# EAGLE design Amstrad-CPC-Z80-DART-1-0 (EAGLE 9.6.2)
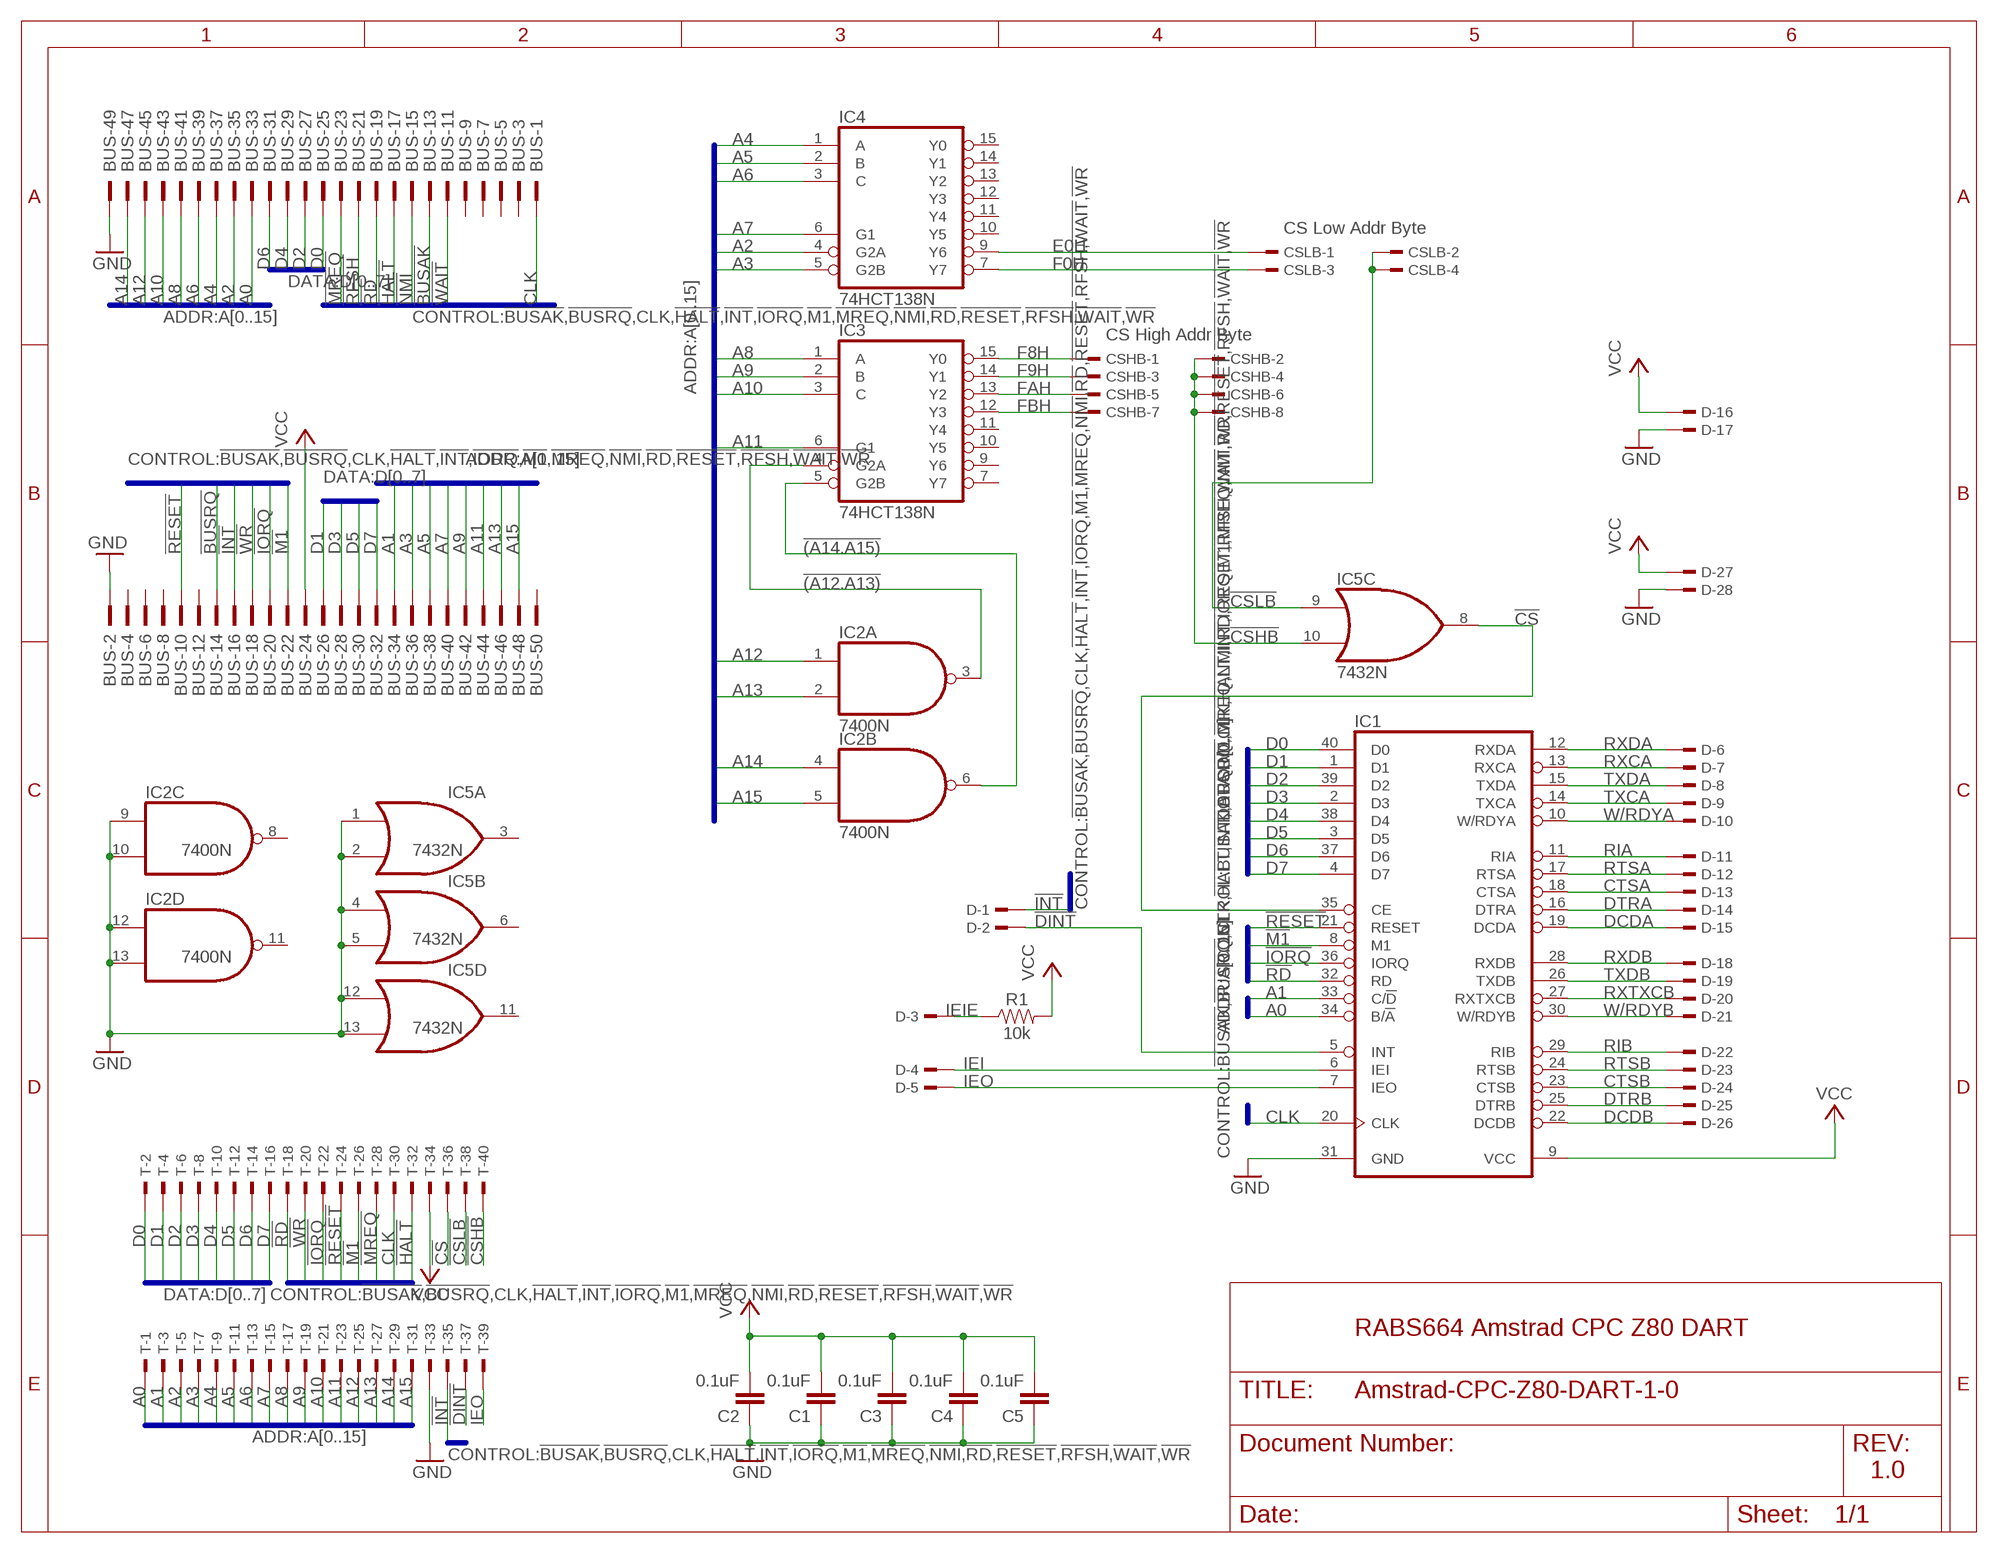
[diagram p0: schematic, sheet 1]

## Parts
BUS  2550-  [PAK100/2500-50]
C1  0.1uF  C-EU050-025X075  [C050-025X075]
C2  0.1uF  C-EU050-025X075  [C050-025X075]
C3  0.1uF  C-EU050-025X075  [C050-025X075]
C4  0.1uF  C-EU050-025X075  [C050-025X075]
C5  0.1uF  C-EU050-025X075  [C050-025X075]
CSHB  TSW-104-07-G-D  [TSW-104-XX-G-D]
CSLB  TSW-102-07-G-D  [TSW-102-XX-G-D]
D  TSW-128-07-G-S  [TSW-128-XX-G-S]
IC1  Z80DART  [DIL40]
IC2  7400N  [DIL14]
IC3  74HCT138N  [DIL16]
IC4  74HCT138N  [DIL16]
IC5  7432N  [DIL14]
R1  10k  10KOHM-HORIZ-1/4W-1%  [AXIAL-0.3]
T  TSW-120-07-G-D  [TSW-120-XX-G-D]

## Nets
!(A12.A13): IC2.3(A:O) IC3.4(G2A)
!(A14.A15): IC2.6(B:O) IC3.5(G2B)
!BUSAK: BUS.13
!BUSRQ: BUS.14
!CS: IC1.35(CE) IC5.8(C:O) T.36
!CSHB: CSHB.2 CSHB.4 CSHB.6 CSHB.8 IC5.10(C:I1) T.40
!CSLB: CSLB.2 CSLB.4 IC5.9(C:I0) T.38
!DINT: D.2 IC1.5(INT) T.37
!HALT: BUS.17 T.32
!INT: BUS.16 D.1 T.35
!IORQ: BUS.20 IC1.36(IORQ) T.22
!M1: BUS.22 IC1.8(M1) T.26
!MREQ: BUS.23 T.28
!NMI: BUS.15
!RD: BUS.19 IC1.32(RD) T.18
!RESET: BUS.10 IC1.21(RESET) T.24
!RFSH: BUS.21
!WAIT: BUS.11
!WR: BUS.18 T.20
A0: BUS.33 IC1.34(B/!A) T.1
A1: BUS.34 IC1.33(C/!D) T.3
A2: BUS.35 IC4.4(G2A) T.5
A3: BUS.36 IC4.5(G2B) T.7
A4: BUS.37 IC4.1(A) T.9
A5: BUS.38 IC4.2(B) T.11
A6: BUS.39 IC4.3(C) T.13
A7: BUS.40 IC4.6(G1) T.15
A8: BUS.41 IC3.1(A) T.17
A9: BUS.42 IC3.2(B) T.19
A10: BUS.43 IC3.3(C) T.21
A11: BUS.44 IC3.6(G1) T.23
A12: BUS.45 IC2.1(A:I0) T.25
A13: BUS.46 IC2.2(A:I1) T.27
A14: BUS.47 IC2.4(B:I0) T.29
A15: BUS.48 IC2.5(B:I1) T.31
CLK: BUS.1 IC1.20(CLK) T.30
CTSA: D.13 IC1.18(CTSA)
CTSB: D.24 IC1.23(CTSB)
D0: BUS.25 IC1.40(D0) T.2
D1: BUS.26 IC1.1(D1) T.4
D2: BUS.27 IC1.39(D2) T.6
D3: BUS.28 IC1.2(D3) T.8
D4: BUS.29 IC1.38(D4) T.10
D5: BUS.30 IC1.3(D5) T.12
D6: BUS.31 IC1.37(D6) T.14
D7: BUS.32 IC1.4(D7) T.16
DCDA: D.15 IC1.19(DCDA)
DCDB: D.26 IC1.22(DCDB)
DTRA: D.14 IC1.16(DTRA)
DTRB: D.25 IC1.25(DTRB)
E0H: CSLB.1 IC4.9(Y6)
F0H: CSLB.3 IC4.7(Y7)
F8H: CSHB.1 IC3.15(Y0)
F9H: CSHB.3 IC3.14(Y1)
FAH: CSHB.5 IC3.13(Y2)
FBH: CSHB.7 IC3.12(Y3)
GND [supply]: BUS.2 BUS.49 C1.1 C2.1 C3.1 C4.1 C5.1 D.17 D.28 IC1.31(GND) IC2.9(C:I0) IC2.10(C:I1) IC2.12(D:I0) IC2.13(D:I1) IC5.1(A:I0) IC5.2(A:I1) IC5.4(B:I0) IC5.5(B:I1) IC5.12(D:I0) IC5.13(D:I1) T.33
IEI: D.4 IC1.6(IEI)
IEIE: D.3 R1.P$1
IEO: D.5 IC1.7(IEO) T.39
RIA: D.11 IC1.11(RIA)
RIB: D.22 IC1.29(RIB)
RTSA: D.12 IC1.17(RTSA)
RTSB: D.23 IC1.24(RTSB)
RXCA: D.7 IC1.13(RXCA)
RXDA: D.6 IC1.12(RXDA)
RXDB: D.18 IC1.28(RXDB)
RXTXCB: D.20 IC1.27(RXTXCB)
TXCA: D.9 IC1.14(TXCA)
TXDA: D.8 IC1.15(TXDA)
TXDB: D.19 IC1.26(TXDB)
VCC [supply]: BUS.24 C1.2 C2.2 C3.2 C4.2 C5.2 D.16 D.27 IC1.9(VCC) R1.P$2 T.34
W/RDYA: D.10 IC1.10(W/RDYA)
W/RDYB: D.21 IC1.30(W/RDYB)
Unconnected: BUS.3 BUS.4 BUS.5 BUS.6 BUS.7 BUS.8 BUS.9 BUS.12 BUS.50 IC2.8(C:O) IC2.11(D:O) IC3.7(Y7) IC3.9(Y6) IC3.10(Y5) IC3.11(Y4) IC4.10(Y5) IC4.11(Y4) IC4.12(Y3) IC4.13(Y2) IC4.14(Y1) IC4.15(Y0) IC5.3(A:O) IC5.6(B:O) IC5.11(D:O)

## Buses
ADDR:A[0..15]
DATA:D[0..7]
CONTROL:!BUSAK,!BUSRQ,CLK,!HALT,!INT,!IORQ,!M1,!MREQ,!NMI,!RD,!RESET,!RFSH,!WAIT,!WR

## Notes on the sheet
- CS Low Addr Byte
- CS High Addr Byte
- RABS664 Amstrad CPC Z80 DART
- 1.0

## Power pins joined to a net without a drawn wire
GND: IC2.7(P:GND) IC3.8(GND) IC4.8(GND) IC5.7(P:GND)
VCC: IC2.14(P:VCC) IC3.16(VCC) IC4.16(VCC) IC5.14(P:VCC)

## Library data of the parts
BUS = con-3m:2550-: 3M (TM) Pak 100 4-Wall Header Source: 3M; OC_FARNELL: unknown; OC_NEWARK: unknown; SPICEPREFIX: X
C1-C5 = rcl:C-EU: CAPACITOR, European symbol; SPICEPREFIX: C
CSHB = con-samtec:TSW-104-*-G: THROUGH-HOLE .025" SQ POST HEADER Source: Samtec TSW.pdf; MF: Samtec Inc.; MPN: TSW-104-07-G-D
CSLB = con-samtec:TSW-102-*-G: THROUGH-HOLE .025" SQ POST HEADER Source: Samtec TSW.pdf; MF: Samtec Inc.; MPN: TSW-102-07-G-D
D = con-samtec:TSW-128-*-G-S: THROUGH-HOLE .025" SQ POST HEADER Source: Samtec TSW.pdf; MF: Samtec Inc.; MPN: TSW-128-07-G-S
IC1 = zilog:Z80DART: Z80 FAMILY DEVICE
IC2 = 74xx-us:74*00: Quad 2-input NAND gate
IC3 IC4 = 74xx-eu:74*138: 3-line to 8-line DECODER/DEMULTIPLEXER
IC5 = 74xx-us:74*32: Quad 2-input OR gate
R1 = SparkFun-Resistors:10KOHM: 10kΩ resistor A resistor is a passive two-terminal electrical component that implements electrical resistance as a circuit element. Resistors act to reduce current flow, and, at the same time, act to lower voltage levels within circuits. - Wikipedia; PROD_ID: RES-12183
T = con-samtec:TSW-120-*-G: THROUGH-HOLE .025" SQ POST HEADER Source: Samtec TSW.pdf; MF: Samtec Inc.; MPN: TSW-120-07-G-D

## Net classes
0 default: width 0.254 mm, clearance 0.254 mm
1 supply: width 0.508 mm, clearance 0.508 mm

## Board
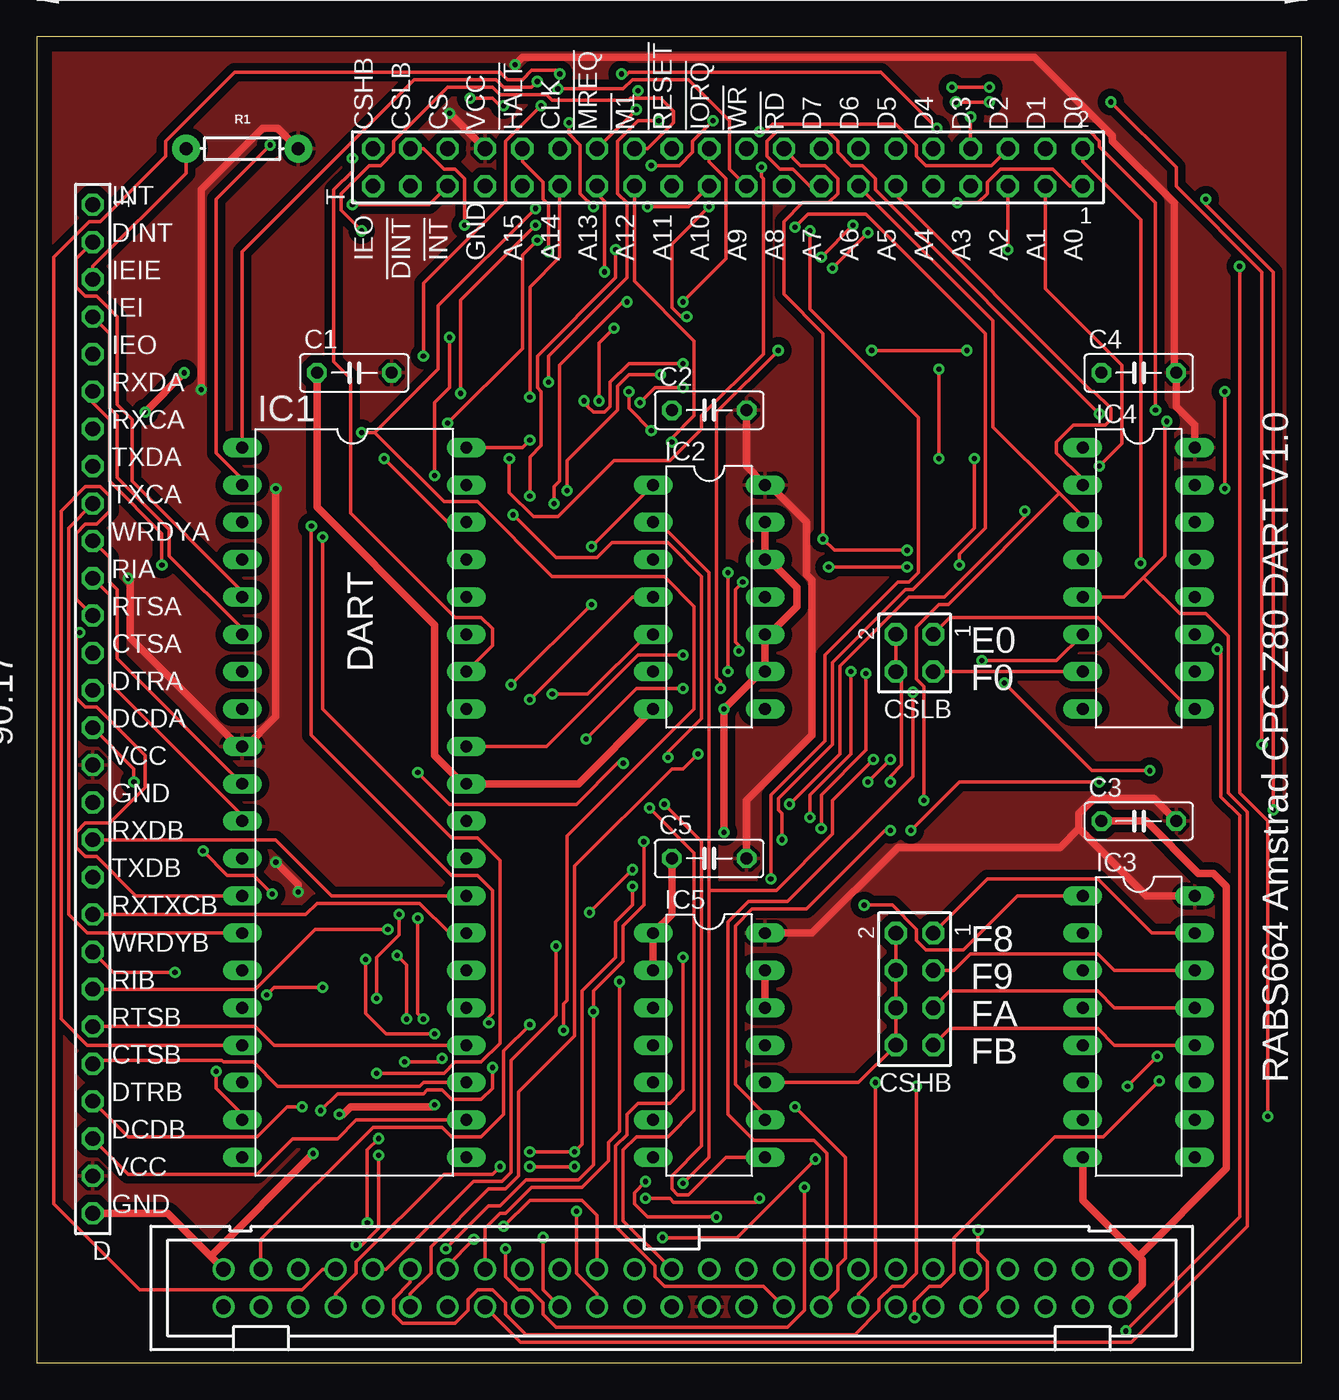
[diagram p1: board, top side]
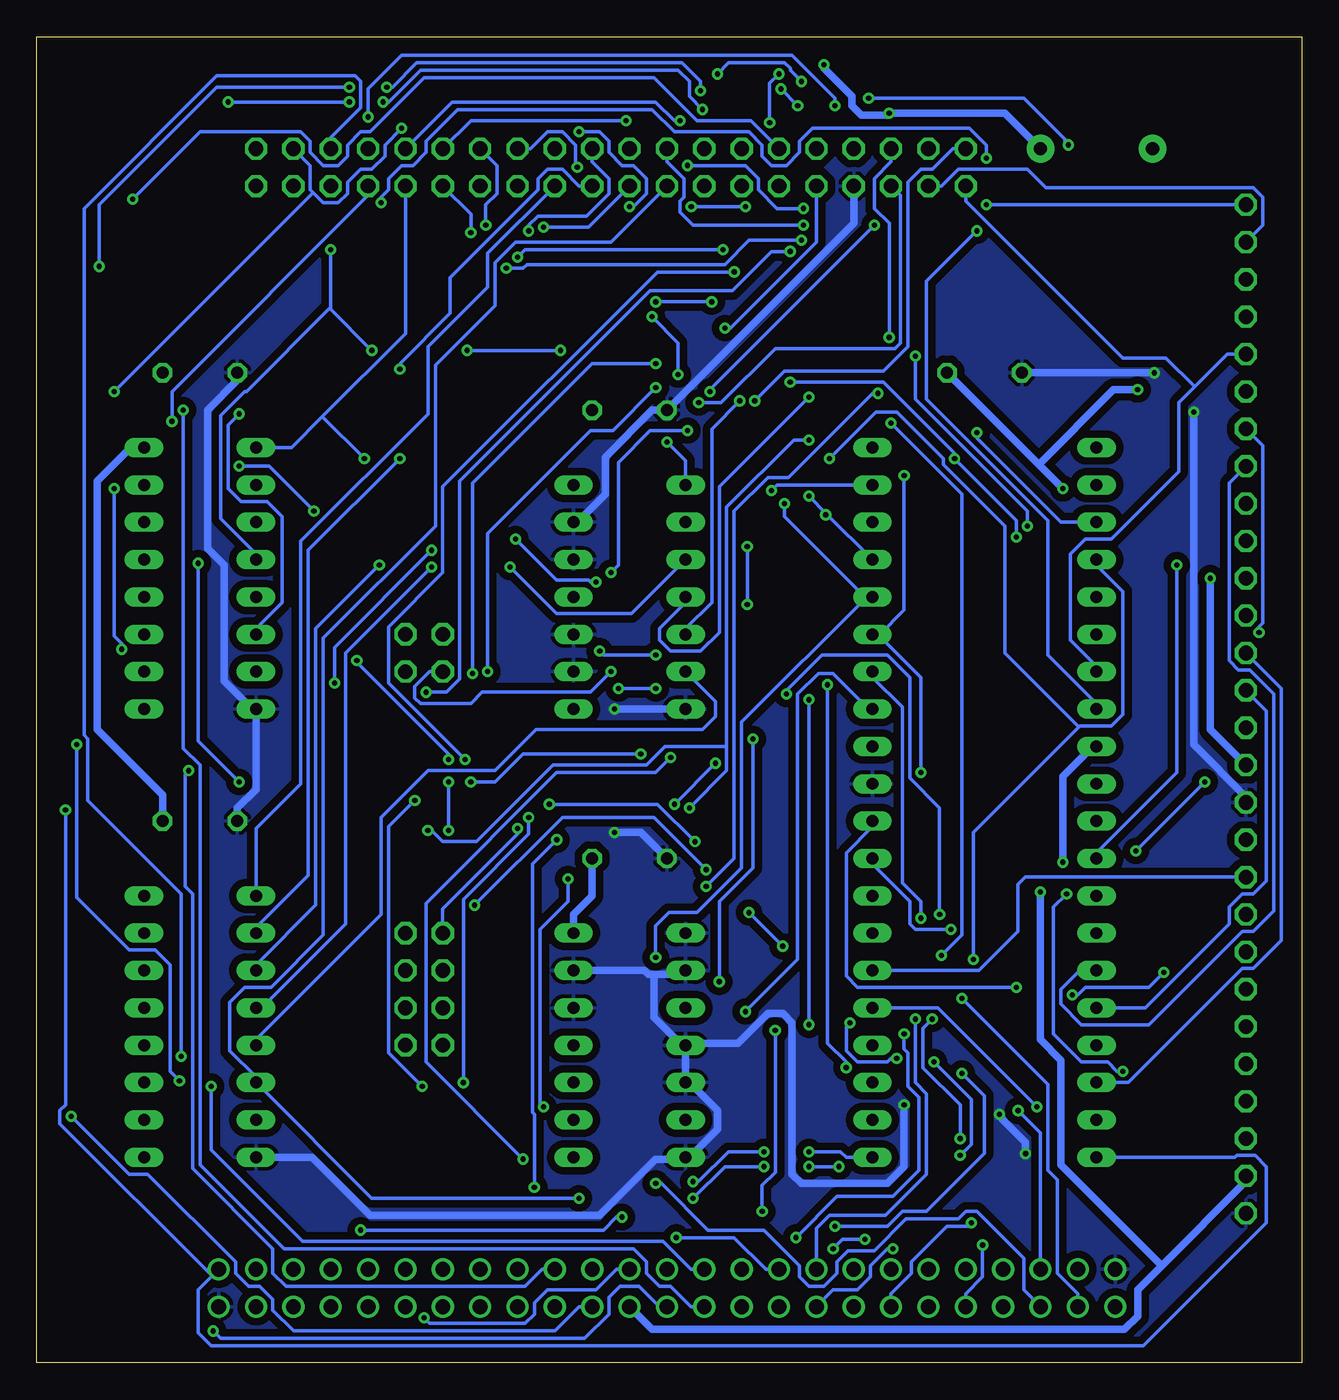
[diagram p2: board, bottom side, seen from below]

Size 86.03 x 90.16 mm. Coordinates in mm from the lower left corner, seen from the top.
Outline: 0,0 86.03,0 86.03,90.16 0,90.16 0,0
Copper layers (1*16): Top 0.035mm / dielectric 1.5mm / Bottom 0.035mm
Design rules "default": minimum track width 6mil, minimum drill 0.35mm, track to track 6mil, track to pad 6mil, pad to pad 6mil, via to via 6mil, smd to smd 6mil, copper to edge 40mil, drill to drill 6mil, minimum pad ring 10mil, minimum via ring 8mil, stop-mask expansion 4mil, vias tented up to drill 0mil, thermal gap 10mil

### Footprints (pad centres in the part's own frame; a part is rotated, then mirrored left to right if it is on the bottom)
PAK100/2500-50 = drill 1 pad 1.422: 1 -30.48,-1.27; 2 -30.48,1.27; 3 -27.94,-1.27; 4 -27.94,1.27; 5 -25.4,-1.27; 6 -25.4,1.27; 7 -22.86,-1.27; 8 -22.86,1.27; 9 -20.32,-1.27; 10 -20.32,1.27; 11 -17.78,-1.27; 12 -17.78,1.27; 13 -15.24,-1.27; 14 -15.24,1.27; 15 -12.7,-1.27; 16 -12.7,1.27; 17 -10.16,-1.27; 18 -10.16,1.27; 19 -7.62,-1.27; 20 -7.62,1.27; 21 -5.08,-1.27; 22 -5.08,1.27; 23 -2.54,-1.27; 24 -2.54,1.27; 25 0,-1.27; 26 0,1.27; 27 2.54,-1.27; 28 2.54,1.27; 29 5.08,-1.27; 30 5.08,1.27; 31 7.62,-1.27; 32 7.62,1.27; 33 10.16,-1.27; 34 10.16,1.27; 35 12.7,-1.27; 36 12.7,1.27; 37 15.24,-1.27; 38 15.24,1.27; 39 17.78,-1.27; 40 17.78,1.27; 41 20.32,-1.27; 42 20.32,1.27; 43 22.86,-1.27; 44 22.86,1.27; 45 25.4,-1.27; 46 25.4,1.27; 47 27.94,-1.27; 48 27.94,1.27; 49 30.48,-1.27; 50 30.48,1.27
C050-025X075 = drill 0.813 octagon: 1 -2.54,0; 2 2.54,0
TSW-104-XX-G-D = drill 1 pad 1.5 octagon: 1 3.81,-1.27; 2 3.81,1.27; 3 1.27,-1.27; 4 1.27,1.27; 5 -1.27,-1.27; 6 -1.27,1.27; 7 -3.81,-1.27; 8 -3.81,1.27
TSW-102-XX-G-D = drill 1 pad 1.5 octagon: 1 1.27,-1.27; 2 1.27,1.27; 3 -1.27,-1.27; 4 -1.27,1.27
TSW-128-XX-G-S = drill 1 pad 1.5 octagon: 1 34.29,0; 2 31.75,0; 3 29.21,0; 4 26.67,0; 5 24.13,0; 6 21.59,0; 7 19.05,0; 8 16.51,0; 9 13.97,0; 10 11.43,0; 11 8.89,0; 12 6.35,0; 13 3.81,0; 14 1.27,0; 15 -1.27,0; 16 -3.81,0; 17 -6.35,0; 18 -8.89,0; 19 -11.43,0; 20 -13.97,0; 21 -16.51,0; 22 -19.05,0; 23 -21.59,0; 24 -24.13,0; 25 -26.67,0; 26 -29.21,0; 27 -31.75,0; 28 -34.29,0
DIL40 = drill 0.813 long: 1 -24.13,-7.62; 2 -21.59,-7.62; 3 -19.05,-7.62; 4 -16.51,-7.62; 5 -13.97,-7.62; 6 -11.43,-7.62; 7 -8.89,-7.62; 8 -6.35,-7.62; 9 -3.81,-7.62; 10 -1.27,-7.62; 11 1.27,-7.62; 12 3.81,-7.62; 13 6.35,-7.62; 14 8.89,-7.62; 15 11.43,-7.62; 16 13.97,-7.62; 17 16.51,-7.62; 18 19.05,-7.62; 19 21.59,-7.62; 20 24.13,-7.62; 21 24.13,7.62; 22 21.59,7.62; 23 19.05,7.62; 24 16.51,7.62; 25 13.97,7.62; 26 11.43,7.62; 27 8.89,7.62; 28 6.35,7.62; 29 3.81,7.62; 30 1.27,7.62; 31 -1.27,7.62; 32 -3.81,7.62; 33 -6.35,7.62; 34 -8.89,7.62; 35 -11.43,7.62; 36 -13.97,7.62; 37 -16.51,7.62; 38 -19.05,7.62; 39 -21.59,7.62; 40 -24.13,7.62
DIL14 = drill 0.813 long: 1 -7.62,-3.81; 2 -5.08,-3.81; 3 -2.54,-3.81; 4 0,-3.81; 5 2.54,-3.81; 6 5.08,-3.81; 7 7.62,-3.81; 8 7.62,3.81; 9 5.08,3.81; 10 2.54,3.81; 11 0,3.81; 12 -2.54,3.81; 13 -5.08,3.81; 14 -7.62,3.81
DIL16 = drill 0.813 long: 1 -8.89,-3.81; 2 -6.35,-3.81; 3 -3.81,-3.81; 4 -1.27,-3.81; 5 1.27,-3.81; 6 3.81,-3.81; 7 6.35,-3.81; 8 8.89,-3.81; 9 8.89,3.81; 10 6.35,3.81; 11 3.81,3.81; 12 1.27,3.81; 13 -1.27,3.81; 14 -3.81,3.81; 15 -6.35,3.81; 16 -8.89,3.81
AXIAL-0.3 = drill 0.9 pad 1.88: P$1 -3.81,0; P$2 3.81,0
TSW-120-XX-G-D = drill 1 pad 1.5 octagon: 1 24.13,-1.27; 2 24.13,1.27; 3 21.59,-1.27; 4 21.59,1.27; 5 19.05,-1.27; 6 19.05,1.27; 7 16.51,-1.27; 8 16.51,1.27; 9 13.97,-1.27; 10 13.97,1.27; 11 11.43,-1.27; 12 11.43,1.27; 13 8.89,-1.27; 14 8.89,1.27; 15 6.35,-1.27; 16 6.35,1.27; 17 3.81,-1.27; 18 3.81,1.27; 19 1.27,-1.27; 20 1.27,1.27; 21 -1.27,-1.27; 22 -1.27,1.27; 23 -3.81,-1.27; 24 -3.81,1.27; 25 -6.35,-1.27; 26 -6.35,1.27; 27 -8.89,-1.27; 28 -8.89,1.27; 29 -11.43,-1.27; 30 -11.43,1.27; 31 -13.97,-1.27; 32 -13.97,1.27; 33 -16.51,-1.27; 34 -16.51,1.27; 35 -19.05,-1.27; 36 -19.05,1.27; 37 -21.59,-1.27; 38 -21.59,1.27; 39 -24.13,-1.27; 40 -24.13,1.27

### Placement (x,y rotation side)
BUS  43.18,5.08 180 top
C1  21.59,67.31 0 top
C2  45.72,64.77 0 top
C3  74.93,36.83 0 top
C4  74.93,67.31 0 top
C5  45.72,34.29 0 top
CSHB  59.69,25.4 90 top
CSLB  59.69,48.26 90 top
D  3.81,44.45 90 top
IC1  21.59,38.1 270 top
IC2  45.72,52.07 270 top
IC3  74.93,22.86 270 top
IC4  74.93,53.34 270 top
IC5  45.72,21.59 270 top
R1  13.97,82.55 0 top
T  46.99,81.28 0 top

### Tracks (layer width: path | path; a pad name or v marks a point on that pad's centre or on a via)
!(A12.A13)  (via drill 0.35)
  Top 0.254: v53.85,54.1 v59.18,54.1
  Bottom 0.254: IC3.4 70.74,24.13 65.02,29.84 65.02,48.26 v59.18,54.1 | v53.85,54.1 50.67,50.93 45.59,50.93 IC2.3
!(A14.A15)
  Bottom 0.254: IC3.5 71.12,21.97 62.61,30.48 62.61,37.08 59.44,40.26 54.86,40.26 52.07,43.05 40.77,43.05 39.88,43.94 39.88,44.96 IC2.6
!CS  (via drill 0.35)
  Top 0.254: IC5.8 46.86,13.97 44.32,11.43 43.56,11.43 43.18,11.81 43.18,12.7 45.21,14.73 45.21,35.43 v42.67,37.97 | v39.88,40.77 39.5,40.77 36.7,37.97 28.07,37.97 v25.91,40.13 | v28.07,69.72 28.07,66.29 27.05,65.28 v27.05,60.33
  Bottom 0.254: v39.88,40.77 v42.67,37.97 | v25.91,40.13 25.91,46.61 28.83,49.53 IC1.35 28.7,49.53 27.05,51.18 v27.05,60.33 | T.36 27.94,81.66 29.08,80.52 29.08,78.49 28.07,77.47 v28.07,69.72
!CSHB  (via drill 0.35)
  Top 0.254: IC5.10 55.88,19.05 CSHB.8 CSHB.6 CSHB.4 CSHB.2 | v37.21,65.41 37.47,65.15 37.47,65.02 37.85,64.64 38.61,64.64 38.99,65.02 38.99,66.67 40.26,67.94 v43.94,67.94 | v56.39,46.86 56.39,41.66 53.34,38.61 v53.34,36.32
  Bottom 0.254: T.40 23.75,82.55 25.15,81.15 25.91,81.15 26.8,80.26 26.8,69.09 28.45,67.44 35.18,67.44 v37.21,65.41 | v43.94,67.94 48.26,67.94 56.39,59.82 v56.39,46.86 | v53.34,36.32 53.34,35.94 58.42,30.86 CSHB.2
!CSLB  (via drill 0.35)
  Top 0.254: IC5.9 49.53,16.89 47.5,18.92 47.5,29.72 48.64,30.86 52.32,30.86 57.66,36.2 v58.04,36.2 | v58.04,39.5 58.04,39.88 58.8,40.64 58.8,46.61 CSLB.4 CSLB.2 | T.38 26.29,82.55 27.69,81.15 28.45,81.15 29.08,80.52 v29.08,77.34 | v40.26,66.04 40.26,64.9 v41.78,63.37 | v46.99,46.99 v46.99,53.72
  Bottom 0.254: v58.04,39.5 v58.04,36.2 | v29.08,77.34 40.26,66.17 v40.26,66.04 | v41.78,63.37 44.32,63.37 46.48,61.21 46.48,54.23 v46.99,53.72 | v46.99,46.99 48.39,45.59 55.75,45.59 56.52,44.83 59.94,44.83 60.33,45.21 60.33,45.97 59.31,46.99 CSLB.4
!DINT
  Top 0.254: IC1.5 13.97,52.45 6.48,59.94 6.48,64.14 5.46,65.15 5.46,71.12 4.06,72.52 3.3,72.52 2.67,73.15 2.67,75.06 D.2
  Bottom 0.254: T.37 24.51,80.01 23.37,81.15 18.67,81.15 17.4,79.88 3.3,79.88 2.67,79.25 2.67,77.34 D.2
!HALT  (via drill 0.35)
  Top 0.254: T.32 33.02,81.66 34.42,80.26 34.42,79.12 34.8,78.74 v34.8,75.56 | v59.56,45.59 59.56,39.88 51.05,31.37 48.39,31.37 46.99,29.97 46.99,16.89 48.77,15.11 52.83,15.11 53.72,14.22 53.72,6.73 BUS.17
  Bottom 0.254: v34.8,75.56 36.07,75.56 38.73,72.9 44.32,72.9 57.28,59.94 57.28,46.48 58.17,45.59 v59.56,45.59
!INT  (via drill 0.35)
  Top 0.254: v21.46,78.74 26.67,78.74 T.35 | BUS.16 55.88,4.7 57.02,5.84 v57.02,19.05 | v52.58,37.08 52.58,38.61 55.37,41.4 v55.37,46.99 | v43.94,66.29 42.04,66.29 v41.02,65.28
  Bottom 0.254: v21.46,78.74 D.1 | v57.02,19.05 57.02,31.5 52.58,35.94 v52.58,37.08 | v55.37,46.99 55.37,56.39 48.39,63.37 46.86,63.37 v43.94,66.29 | v41.02,65.28 39.5,65.28 35.81,68.96 27.69,68.96 27.3,69.34 27.3,79.38 T.35
!IORQ  (via drill 0.35)
  Top 0.254: v43.94,27.56 43.94,18.54 43.05,17.65 40.89,17.65 40.13,16.89 40.13,15.49 39.37,14.73 39.37,9.27 42.04,6.6 42.04,5.84 42.67,5.21 49.4,5.21 BUS.20 | T.22 45.72,81.66 46.86,80.52 46.86,75.06 v43.94,72.14 | v40.13,72.14 39.88,72.14 35.56,67.82 35.56,59.94 35.18,59.56 v35.18,58.42
  Bottom 0.254: v43.94,27.56 43.94,29.72 43.05,30.61 41.15,30.61 38.1,33.66 38.1,43.56 29.59,52.07 IC1.36 29.72,52.07 35.18,57.53 v35.18,58.42 | v40.13,72.14 v43.94,72.14
!M1  (via drill 0.35)
  Top 0.254: v22.1,76.96 20.7,78.36 20.7,79.5 22.61,81.41 23.37,81.41 24.26,82.3 24.26,83.06 27.94,86.74 30.99,86.74 31.5,86.23 34.67,86.23 35.05,85.85 40.26,85.85 40.39,85.98 40.89,85.98 | 40.89,85.98 42.42,85.98 43.31,85.09 43.31,84.33 41.53,82.55 T.26 | v83.69,16.76 83.69,36.83 81.79,38.73 v81.79,74.55 | v62.23,86.74 v64.77,86.74 | 40.89,85.98 v40.89,86.49
  Bottom 0.254: IC1.8 13.97,44.83 17.27,48.13 17.27,57.28 25.53,65.53 25.53,73.53 v22.1,76.96 | BUS.22 49.15,3.81 50.8,2.16 68.58,2.16 69.98,3.56 69.98,4.32 70.87,5.21 71.63,5.21 72.52,6.1 72.52,6.86 78.49,12.83 79.76,12.83 v83.69,16.76 | v81.79,74.55 81.79,78.74 73.79,86.74 v64.77,86.74 | v62.23,86.74 61.85,86.74 60.2,88.39 42.16,88.39 40.89,87.12 v40.89,86.49
!MREQ  (via drill 0.35)
  Top 0.254: v59.69,3.05 59.69,4.19 60.71,5.21 61.47,5.21 62.36,6.1 62.36,8.51 69.22,15.37 72.52,15.37 v76.33,19.18 | v83.31,42.04 83.31,74.17 77.47,80.01 77.47,81.28 v73.03,85.72 | v62.48,85.72 v64.77,85.72 | T.28 v40.77,85.22
  Bottom 0.254: BUS.23 46.61,6.35 48.01,4.95 51.31,4.95 52.2,4.06 52.2,3.3 52.83,2.67 59.31,2.67 v59.69,3.05 | v76.33,19.18 76.96,19.81 76.96,27.05 77.98,28.07 79.76,28.07 83.31,31.62 v83.31,42.04 | v64.77,85.72 v73.03,85.72 | v62.48,85.72 62.1,85.72 59.94,87.88 42.42,87.88 41.66,87.12 41.66,86.11 v40.77,85.22
!RD  (via drill 0.35)
  Top 0.254: IC1.32 34.67,41.91 40.89,48.13 v43.94,48.13 | v47.75,48.39 47.75,48.77 47.5,49.02 47.5,52.58 v48.01,53.09 | T.18 51.94,81.41 53.59,81.41 54.48,80.52 54.48,79.5 53.85,78.87 52.07,78.87 50.8,77.6 50.8,72.64 53.47,69.98 v53.47,56.01 54.23,55.24 v59.18,55.24 | v75.69,40.26 71.75,40.26 v65.79,46.23
  Bottom 0.254: v43.94,48.13 47.5,48.13 v47.75,48.39 | v48.01,53.09 48.39,53.09 48.51,53.21 50.67,53.21 v53.47,56.01 | BUS.19 51.69,6.35 52.83,5.21 69.09,5.21 69.98,6.1 69.98,7.75 75.44,13.21 75.44,31.88 75.95,32.38 75.95,40.01 v75.69,40.26 | v65.79,46.23 65.79,48.64 v59.18,55.24
!RESET  (via drill 0.35)
  Top 0.254: v33.53,14.35 v36.58,14.35 37.08,14.86 37.08,25.27 39.37,27.56 39.37,29.97 40.51,31.11 v40.51,32.38 | v41.4,12.32 40.64,11.56 40.64,10.79 41.53,9.91 v46.23,9.91 | v64.01,9.02 64.01,7.49 64.64,6.86 64.64,4.95 BUS.10 | v33.91,77.34 28.83,72.26 v28.83,65.91
  Bottom 0.254: IC1.21 30.99,13.97 31.37,14.35 v33.53,14.35 | v36.58,14.35 38.99,14.35 41.02,12.32 v41.4,12.32 | v46.23,9.91 46.61,9.91 47.5,9.02 v64.01,9.02 | T.24 43.18,81.66 42.04,80.52 42.04,79.25 42.29,78.99 42.29,78.23 41.4,77.34 v33.91,77.34 | v28.83,65.91 29.21,65.91 34.92,60.2 36.32,60.2 38.61,57.91 38.61,34.29 v40.51,32.38
!WR  (via drill 0.35)
  Top 0.254: v52.58,76.96 52.58,71.63 59.94,64.26 59.94,53.72 59.31,53.09 58.55,53.09 53.59,48.13 53.59,42.29 49.91,38.61 v49.91,32.89 | v51.56,17.4 54.99,13.97 54.99,7.11 54.48,6.6 54.48,4.95 BUS.18
  Bottom 0.254: T.20 48.26,81.66 47.12,80.52 47.12,79.5 48.64,77.98 51.94,77.98 52.58,77.34 v52.58,76.96 | v49.91,32.89 49.91,31.37 51.82,29.46 51.82,17.65 v51.56,17.4
A0  (via drill 0.35)
  Top 0.254: v25.91,30.23 25.91,23.75 v26.29,23.37 | T.1 70.23,80.01 69.09,81.15 65.53,81.15 64.64,80.26 64.64,79.5 64.01,78.87 v62.61,78.87 | v21.46,81.92 21.46,81.03 20.19,79.76 20.19,68.07 21.34,66.93 21.34,57.78 28.45,50.67 30.23,50.67 30.99,49.91 30.99,48.77 IC1.34
  Bottom 0.254: IC1.34 29.21,46.61 27.18,44.58 27.18,32.64 25.91,31.37 v25.91,30.23 | v26.29,23.37 26.29,19.05 25.53,18.29 25.53,12.83 28.32,10.03 32.13,10.03 33.02,9.14 BUS.33 | v62.61,78.87 62.61,79.25 62.1,79.76 62.1,80.52 61.21,81.41 60.45,81.41 59.56,82.3 59.56,83.06 57.4,85.22 44.2,85.22 42.67,83.69 37.59,83.69 36.7,82.8 36.7,82.04 36.07,81.41 35.05,81.41 34.16,82.3 34.16,83.06 33.27,83.95 22.61,83.95 21.46,82.8 v21.46,81.92
A1  (via drill 0.35)
  Top 0.254: v27.81,7.75 30.73,10.67 31.5,10.67 33.27,12.45 36.83,12.45 37.85,13.46 v37.85,23.88 37.85,25.27 39.88,27.3 39.88,29.72 41.27,31.11 v41.27,35.43 | T.3 68.58,73.03 73.79,67.82 73.79,62.48 v72.26,60.96 | v67.18,57.91 67.18,57.53 61.72,52.07 59.31,52.07 54.61,47.37 54.61,41.4 v51.18,37.97
  Bottom 0.254: IC1.33 29.46,44.45 31.88,46.86 32.89,46.86 34.29,45.47 34.29,27.43 v37.85,23.88 | v27.81,7.75 28.19,7.75 29.34,6.6 29.34,5.84 30.23,4.95 31.88,4.95 BUS.34 | v72.26,60.96 70.23,60.96 v67.18,57.91 | v51.18,37.97 43.81,37.97 v41.27,35.43
A2  (via drill 0.35)
  Top 0.254: T.5 v66.04,75.69 | BUS.35 30.48,9.14 31.5,10.16 31.88,10.16 33.66,11.94 37.08,11.94 38.86,13.72 38.86,14.99 39.62,15.75 v39.62,25.91 | v37.34,42.42 40.77,45.85 v43.94,45.85 | v46.48,45.85 46.48,46.35 46.23,46.61 46.23,64.64 v50.42,68.83 | v63.25,68.83 v56.77,68.83
  Bottom 0.254: IC4.4 71.12,54.99 73.53,57.4 73.53,64.39 71.88,66.04 71.75,66.04 66.1,71.69 | 66.1,71.69 66.04,71.75 v66.04,75.69 | v39.62,25.91 39.62,31.37 37.34,33.66 v37.34,42.42 | v46.48,45.85 v43.94,45.85 | v56.77,68.83 v50.42,68.83 | 66.1,71.69 v63.25,68.83
A3  (via drill 0.35)
  Top 0.254: IC4.5 73.91,52.07 75.25,53.4 | 75.25,53.4 76.71,54.86 76.71,63.88 v76.83,64.01 | BUS.36 32.89,1.4 74.42,1.4 82.3,9.27 82.3,37.47 81.03,38.73 81.03,49.4 79.5,50.93 77.72,50.93 75.25,53.4
  Bottom 0.254: v76.83,64.01 76.83,66.04 63.5,79.38 T.7
A4  (via drill 0.35)
  Top 0.254: BUS.37 27.94,6.6 v29.72,8.38 | v31.88,7.75 31.88,5.84 32.77,4.95 33.53,4.95 34.42,4.06 34.42,3.3 35.31,2.41 51.05,2.41 52.2,3.56 v52.2,11.94 | v50.67,35.56 50.67,37.34 50.42,37.59 50.42,38.35 54.1,42.04 54.1,47.62 59.05,52.58 59.56,52.58 63.75,56.77 v63.75,61.47
  Bottom 0.254: IC4.1 68.71,62.23 66.61,64.33 | 66.61,64.33 60.96,69.98 T.9 | v29.72,8.38 31.24,8.38 v31.88,7.75 | v52.2,11.94 52.2,16.89 52.32,17.02 52.32,33.91 v50.67,35.56 | 66.61,64.33 v63.75,61.47
A5  (via drill 0.35)
  Top 0.254: IC4.2 71.12,60.07 69.34,61.85 69.34,62.61 70.48,63.75 72.64,63.75 73.03,64.14 73.03,64.9 71.88,66.04 71.75,66.04 58.42,79.38 T.11 | v22.48,9.53 22.48,14.48 v23.24,15.24 | v25.15,23.37 25.15,27.05 v24.51,27.69 | v27.94,63.88 33.02,68.96 33.02,75.31 v34.04,76.33 | v56.52,76.83 v54.1,74.42
  Bottom 0.254: BUS.38 27.94,4.7 26.54,6.1 26.54,6.86 24.13,9.27 22.73,9.27 v22.48,9.53 | v23.24,15.24 23.24,17.53 25.78,20.07 25.78,22.73 v25.15,23.37 | v24.51,27.69 23.11,29.08 23.11,59.05 v27.94,63.88 | v34.04,76.33 37.59,76.33 39.24,74.68 52.7,74.68 52.96,74.42 v54.1,74.42 | v56.52,76.83 56.52,78.11 T.11
A6  (via drill 0.35)
  Top 0.254: IC4.3 71.12,57.53 69.53,59.12 | 69.53,59.12 65.02,63.63 65.02,70.87 T.13 | BUS.39 25.4,5.46 24.26,4.32 24.26,3.3 24.89,2.67 28.45,2.67 29.34,3.56 29.34,4.32 29.97,4.95 30.99,4.95 31.88,4.06 31.88,3.3 33.27,1.91 55.63,1.91 57.28,3.56 57.28,4.32 58.17,5.21 58.93,5.21 59.82,6.1 v59.82,18.8 | v60.33,38.23 60.33,45.97 59.82,46.48 59.82,50.04 61.34,51.56 61.98,51.56 69.53,59.12
  Bottom 0.254: v59.82,18.8 62.1,21.08 62.1,36.45 v60.33,38.23
A7  (via drill 0.35)
  Top 0.254: v72.26,64.52 57.02,79.76 57.02,80.52 56.13,81.41 55.37,81.41 54.48,82.3 54.48,83.06 53.85,83.69 50.29,83.69 49.66,83.06 49.66,82.04 50.55,81.15 51.44,81.15 52.58,80.01 T.15 | BUS.40 25.4,4.7 26.8,6.1 26.8,7.87 30.73,11.81 31.88,11.81 32.77,12.7 32.77,18.41 36.58,22.23 36.58,33.78 43.18,40.39 43.94,40.39 v44.96,41.4 | v58.04,41.02 v56.52,39.5 | v64.26,47.75 69.34,47.75 IC4.6
  Bottom 0.254: IC4.6 71.12,49.91 69.34,51.69 69.34,57.53 70.36,58.55 72.14,58.55 73.03,59.44 73.03,63.75 v72.26,64.52 | v44.96,41.4 52.96,41.4 54.86,39.5 v56.52,39.5 | v58.04,41.02 58.04,41.4 64.26,47.62 v64.26,47.75
A8  (via drill 0.35)
  Top 0.254: BUS.41 23.75,6.35 29.72,12.32 31.62,12.32 32.26,12.95 32.26,20.57 35.31,23.62 v35.31,28.32 | v40.51,33.53 v37.59,30.61 | v56.26,31.11 58.17,31.11 59.82,29.46 59.82,28.7 60.45,28.07 62.99,28.07 66.67,31.75 IC3.1
  Bottom 0.254: IC3.1 71.12,36.32 68.07,39.37 68.07,55.88 59.44,64.52 59.44,69.09 55.37,73.15 55.37,75.44 T.17 | v37.59,30.61 v35.31,28.32 | v40.51,33.53 44.07,37.08 50.29,37.08 v56.26,31.11
A9  (via drill 0.35)
  Top 0.254: v61.34,67.56 v61.34,61.47 | v21.72,8 22.1,8 23.24,9.14 v23.24,14.1 | v25.02,20.45 27.3,20.45 v27.56,20.7 | v30.73,23.11 30.73,23.5 30.99,23.75 30.99,32.13 29.97,33.15 28.19,33.15 18.67,42.67 v18.67,56.9 | v26.29,68.45 26.29,73.41 31.88,78.99 31.88,83.06 v34.29,85.47 | v35.43,86.61 39.88,86.61 40.51,87.25 44.32,87.25 47.12,84.45 47.12,81.15 T.19
  Bottom 0.254: IC3.2 71.12,29.59 67.56,33.15 67.56,55.24 v61.34,61.47 | v61.34,67.56 61.34,67.94 57.91,71.37 57.91,73.79 51.94,79.76 51.94,80.52 51.31,81.15 50.29,81.15 49.15,80.01 T.19 | BUS.42 22.86,4.7 21.72,5.84 v21.72,8 | v23.24,14.1 22.48,14.86 22.48,17.91 v25.02,20.45 | v27.56,20.7 27.94,20.7 28.19,20.45 30.23,20.45 30.99,21.21 30.99,22.86 v30.73,23.11 | v18.67,56.9 18.67,57.91 26.29,65.53 v26.29,68.45 | v35.43,86.61 v34.29,85.47
A10  (via drill 0.35)
  Top 0.254: v62.74,54.23 62.74,54.99 64.52,56.77 64.52,69.98 56.39,78.11 52.45,78.11 v51.56,77.22 | BUS.43 19.43,6.35 18.03,4.95 6.99,4.95 1.14,10.79 1.14,75.18 3.56,77.6 4.32,77.6 8.76,82.04 8.76,83.06 13.46,87.76 31.5,87.76 32,87.25 33.02,87.25 33.66,87.88 35.31,87.88 v35.56,87.63 | v36.2,84.33 36.2,83.57 36.96,82.8 36.96,79.5 v37.85,78.61 | v41.53,78.61 44.32,78.61 T.21
  Bottom 0.254: IC3.3 71.12,27.05 67.06,31.11 67.06,49.91 v62.74,54.23 | v51.56,77.22 48.51,77.22 T.21 | v35.56,87.63 36.2,87 v36.2,84.33 | v41.53,78.61 v37.85,78.61
A11  (via drill 0.35)
  Top 0.254: BUS.44 20.32,4.7 21.72,6.1 21.72,6.86 27.69,12.83 30.99,12.83 v31.5,13.34 | v36.58,13.34 v33.53,13.34 | v41.4,11.18 43.05,11.18 43.31,10.92 48.9,10.92 v49.15,11.18
  Bottom 0.254: T.23 46.99,76.2 53.47,76.2 54.86,74.8 54.86,71.88 58.93,67.82 58.93,56.9 66.55,49.28 66.55,29.08 70.1,25.53 71.88,25.53 72.9,24.51 72.9,21.21 71.12,19.43 IC3.6 63.25,11.18 v49.15,11.18 | v33.53,13.34 v31.5,13.34 | v36.58,13.34 39.24,13.34 v41.4,11.18
A12  (via drill 0.35)
  Top 0.254: v43.18,62.61 43.18,62.87 44.7,64.39 44.7,69.47 40.64,73.53 T.25 | v19.3,17.14 20.45,18.29 26.29,18.29 26.54,18.54 27.56,18.54 28.19,17.91 30.23,17.91 30.99,18.67 v30.99,20.07 | v37.72,51.56 v32.26,46.1 | IC2.1 v37.72,55.5
  Bottom 0.254: IC2.1 41.91,61.34 v43.18,62.61 | BUS.45 17.78,15.62 v19.3,17.14 | v30.99,20.07 30.99,20.45 32.26,21.72 v32.26,46.1 | v37.72,55.5 v37.72,51.56
A13  (via drill 0.35)
  Top 0.254: IC2.2 42.29,57.15 45.72,53.72 45.72,32.13 | 45.72,32.13 45.72,13.97 v43.94,12.19 | T.27 38.1,79.5 38.61,78.99 v38.61,74.17 | v56.9,41.02 54.1,38.23 54.1,35.94 50.29,32.13 45.72,32.13
  Bottom 0.254: v43.94,12.19 43.56,12.19 40.39,9.02 36.58,9.02 34.16,6.6 34.16,5.84 33.53,5.21 32.51,5.21 31.62,6.1 31.62,6.86 30.86,7.62 29.08,7.62 26.92,9.78 23.37,9.78 22.86,10.29 22.1,10.29 18.92,7.11 18.92,4.95 BUS.46 | v38.61,74.17 43.81,74.17 58.42,59.56 58.42,53.72 62.1,50.04 62.1,46.23 v56.9,41.02
A14  (via drill 0.35)
  Top 0.254: v33.53,65.66 33.53,73.15 35.56,75.18 T.29 | BUS.47 15.24,8.38 22.86,16 27.56,16 28.19,15.37 30.23,15.37 31.75,16.89 31.75,21.21 v33.53,22.99 | v33.53,45.09 40.51,52.07 IC2.4
  Bottom 0.254: IC2.4 41.91,51.69 43.69,49.91 43.69,49.15 42.93,48.39 40.89,48.39 39.62,49.66 39.62,59.56 v33.53,65.66 | v33.53,45.09 v33.53,22.99
A15  (via drill 0.35)
  Top 0.254: v38.23,65.41 38.23,69.34 v39.24,70.36 | v23.11,24.77 23.11,27.56 24.64,29.08 v24.64,30.48 | v35.05,45.47 37.47,45.47 41.53,49.53 IC2.5
  Bottom 0.254: IC2.5 41.91,49.91 40.13,51.69 40.13,63.5 v38.23,65.41 | v39.24,70.36 38.86,70.36 33.02,76.2 T.31 | BUS.48 15.24,4.7 16.64,6.1 16.64,12.45 17.27,13.08 17.27,18.92 v23.11,24.77 | v24.64,30.48 24.64,37.72 26.67,39.75 26.67,46.61 28.19,48.13 32.64,48.13 35.05,45.72 v35.05,45.47
CLK  (via drill 0.35)
  Top 0.254: v79.5,79.12 79.5,78.74 84.07,74.17 v84.07,37.59
  Bottom 0.254: IC1.20 4.57,13.97 4.45,14.1 3.17,14.1 2.41,13.34 2.41,9.53 10.79,1.14 74.17,1.14 75.06,2.03 75.06,4.95 BUS.1 74.17,5.97 84.45,16.26 84.45,17.14 84.07,17.53 v84.07,37.59 | T.30 37.47,84.45 41.15,84.45 44.07,87.38 59.69,87.38 63.37,83.69 64.01,83.69 64.9,82.8 64.9,82.04 65.53,81.41 66.55,81.41 67.44,82.3 67.44,83.06 68.07,83.69 74.93,83.69 v79.5,79.12
CTSA
  Bottom 0.254: IC1.18 11.81,19.05 4.06,26.8 3.3,26.8 1.4,28.7 1.4,45.85 D.13
CTSB
  Top 0.254: IC1.23 26.29,19.05 26.04,18.8 16.38,18.8 14.73,20.45 12.7,20.45 12.57,20.57 4.06,20.57 D.24
D0  (via drill 0.35)
  Top 0.254: IC1.40 33.02,62.23 v33.53,62.74 | v41.66,37.72 44.7,34.67 44.7,17.14 42.93,15.37 40.77,15.37 39.88,14.48 39.88,9.65 BUS.25 | T.2 71.12,81.66 75.06,77.72 v75.06,54.36 | v72.26,39.5 62.74,39.5 v59.44,36.2
  Bottom 0.254: v33.53,62.74 34.54,62.74 39.12,58.17 39.12,41.91 | 39.12,41.91 39.12,40.26 v41.66,37.72 | v75.06,54.36 75.06,42.29 v72.26,39.5 | v59.44,36.2 59.18,36.2 58.42,35.43 56.13,35.43 50.93,40.64 44.58,40.64 43.31,41.91 39.12,41.91
D1  (via drill 0.35)
  Top 0.254: IC1.1 13.97,75.56 25.65,87.25 31.24,87.25 31.75,86.74 33.66,86.74 v34.04,87.12 | v39.75,87.63 40.13,87.63 40.26,87.76 57.4,87.76 v61.21,83.95 | v74.04,2.16 81.79,9.91 81.79,37.21 80.52,38.48 80.52,48.26 v80.26,48.51 | v80.77,66.04 v80.77,59.44
  Bottom 0.254: v34.04,87.12 34.8,87.88 34.8,88.01 35.18,88.39 38.99,88.39 v39.75,87.63 | v61.21,83.95 62.36,82.8 62.36,82.04 63.25,81.15 64.01,81.15 64.9,80.26 64.9,79.5 65.53,78.87 66.55,78.87 67.25,79.57 | 67.25,79.57 67.44,79.76 67.44,81.41 T.4 | BUS.26 43.69,3.81 45.09,5.21 46.35,5.21 47.12,4.45 47.12,3.3 48.77,1.65 73.53,1.65 v74.04,2.16 | v80.26,48.51 80.26,48.9 80.77,49.4 v80.77,59.44 | 67.25,79.57 v80.77,66.04
D2  (via drill 0.35)
  Top 0.254: v36.07,59.31 36.07,61.34 39.5,64.77 39.5,66.42 40.26,67.18 v42.42,67.18 | v44.2,71.12 43.81,71.12 43.18,71.75 43.18,76.07 v45.72,78.61 | v49.15,83.69 49.53,83.69 50.04,84.2 58.42,84.2 59.82,82.8 59.82,82.04 60.45,81.41 64.9,81.41 T.6 | v76.2,20.83 v74.17,18.8
  Bottom 0.254: IC1.39 35.69,59.69 v36.07,59.31 | v42.42,67.18 42.42,69.34 v44.2,71.12 | v45.72,78.61 45.47,78.61 44.58,79.5 44.58,80.52 45.47,81.41 46.23,81.41 47.12,82.3 47.12,83.06 47.75,83.69 v49.15,83.69 | BUS.27 41.53,6.35 43.43,8.26 67.94,8.26 74.17,14.48 v74.17,18.8 | v76.2,20.83 76.2,31.88 82.55,38.23 82.55,42.42 82.8,42.67 82.8,78.49 73.79,87.5 64.39,87.5 64.01,87.12 64.01,85.34 66.04,83.31 T.6
D3  (via drill 0.35)
  Top 0.254: IC1.2 13.97,60.07 12.19,61.85 12.19,79.12 v15.88,82.8 | v29.46,85.98 30.99,85.98 31.5,85.47 v31.75,85.47 | T.8 63.5,83.69 | 63.5,83.69 v63.5,84.71 | v76.07,64.77 76.07,78.87 72.26,82.68 72.26,83.06 71.63,83.69 63.5,83.69
  Bottom 0.254: v15.88,82.8 16.13,83.06 16.13,83.19 18.92,85.98 v29.46,85.98 | v31.75,85.47 31.75,85.98 34.67,88.9 61.21,88.9 63.5,86.61 v63.5,84.71 | BUS.28 41.53,3.81 42.93,5.21 43.69,5.21 44.58,6.1 44.58,6.86 45.47,7.75 69.22,7.75 74.93,13.46 74.93,40.64 76.07,41.78 v76.07,64.77
D4  (via drill 0.35)
  Top 0.254: IC1.38 27.94,57.15 v23.62,61.47 | v34.8,66.67 34.8,68.45 40.13,73.79 40.13,78.87 39.5,79.5 39.5,83.06 40.89,84.45 v42.29,84.45 | BUS.29 38.1,10.03 37.08,11.05 33.53,11.05 v31.75,9.27 | v23.11,19.68 27.69,19.68 28.45,20.45 30.23,20.45 31.5,21.72 31.5,34.16 29.97,35.69 28.19,35.69 19.43,44.45 v19.43,56.13
  Bottom 0.254: v34.8,66.67 28.45,66.67 23.62,61.85 v23.62,61.47 19.43,57.28 v19.43,56.13 | v42.29,84.45 42.67,84.45 43.94,85.72 57.78,85.72 T.10 | v31.75,9.27 28.19,9.27 27.18,10.29 25.53,10.29 21.59,14.22 21.59,18.16 v23.11,19.68
D5  (via drill 0.35)
  Top 0.254: 22.99,63.25 v22.1,63.25 | 22.99,63.25 27.3,67.56 27.3,71.88 v33.91,78.49 | v41.78,81.41 43.69,81.41 44.58,82.3 44.58,83.06 v45.97,84.45 | BUS.30 38.1,4.7 36.7,6.1 v36.7,10.29 | v35.81,22.61 35.81,24.38 36.07,24.64 36.07,35.81 44.7,44.45 44.7,51.44 42.67,53.47 35.05,53.47 29.97,58.55 27.69,58.55 22.99,63.25
  Bottom 0.254: IC1.3 16.38,57.15 22.1,62.87 v22.1,63.25 | v33.91,78.49 35.69,78.49 36.96,79.76 36.96,80.52 37.85,81.41 v41.78,81.41 | v45.97,84.45 56.52,84.45 T.12 | v36.7,10.29 36.7,12.06 35.81,12.95 v35.81,22.61
D6  (via drill 0.35)
  Top 0.254: v33.53,58.93 33.53,61.59 34.29,62.36 34.29,66.04 34.04,66.29 34.04,68.45 39.37,73.79 v39.37,75.69 | v55.5,77.34 v53.34,75.18 | v42.55,8.51 47.62,8.51 v52.96,13.84 | v42.93,41.15 42.93,41.53 45.21,43.81 45.21,53.47 42.93,55.75 39.12,55.75 38.1,54.74 35.31,54.74 v32.38,57.66
  Bottom 0.254: v33.53,58.93 32.32,57.72 | 32.32,57.72 IC1.37 | v39.37,75.69 52.83,75.69 v53.34,75.18 | v55.5,77.34 55.5,78.74 54.74,79.5 54.74,81.41 T.14 | BUS.31 36.45,6.35 38.61,8.51 v42.55,8.51 | v52.96,13.84 59.56,20.45 59.56,31.24 50.67,40.13 43.94,40.13 v42.93,41.15 | v32.38,57.66 32.32,57.72
D7  (via drill 0.35)
  Top 0.254: v22.35,27.43 22.35,23.75 23.75,22.35 v27.05,22.35 | v34.42,8.51 34.42,4.95 BUS.32 | v49.28,81.28 49.28,80.64 49.4,80.52 49.4,68.58 45.21,64.39 45.21,63.5 43.05,61.34 39.24,61.34 35.43,57.53 33.78,57.53 32.13,59.18 v32.13,61.47
  Bottom 0.254: IC1.4 13.97,54.23 12.19,52.45 12.19,44.07 12.95,43.31 15.11,43.31 15.18,43.24 | 15.18,43.24 22.35,36.07 v22.35,27.43 | v27.05,22.35 27.05,21.34 26.8,21.08 26.8,18.8 26.04,18.03 26.04,13.08 27.81,11.3 31.62,11.3 v34.42,8.51 | T.16 52.45,82.55 51.31,83.69 50.29,83.69 49.4,82.8 49.4,81.41 v49.28,81.28 | v32.13,61.47 28.96,64.64 27.56,64.64 24.38,61.47 24.38,61.09 20.19,56.9 20.19,48.26 15.18,43.24
DCDA  (via drill 0.35)
  Top 0.254: IC1.19 13.97,16.89 12.19,18.67 v12.19,19.81 | v16,31.88 14.73,33.15 12.95,33.15 v11.3,34.8 | v6.6,39.5 6.6,40.39 D.15
  Bottom 0.254: v12.19,19.81 12.57,19.81 13.21,20.45 14.99,20.45 16.89,22.35 16.89,30.99 v16,31.88 | v6.6,39.5 v11.3,34.8
DCDB
  Top 0.254: IC1.22 21.72,16.51 20.45,15.24 17.4,15.24 14.99,12.83 6.22,12.83 D.26
DTRA
  Bottom 0.254: IC1.16 10.67,24.13 4.95,29.84 4.95,30.99 4.06,31.88 3.3,31.88 2.41,32.77 2.41,44.32 D.14
DTRB  (via drill 0.35)
  Top 0.254: v18.03,17.4 17.02,17.4 14.99,15.37 6.22,15.37 D.25
  Bottom 0.254: IC1.25 24.77,24.13 v18.03,17.4
E0H
  Top 0.254: IC4.9 78.36,44.45 72.14,50.67 62.1,50.67 CSLB.1
F0H
  Top 0.254: CSLB.3 IC4.7
F8H
  Top 0.254: IC3.15 75.82,29.21 72.14,32.89 64.64,32.89 CSHB.1
F9H
  Top 0.254: IC3.14 73.28,26.67 72.14,27.81 63.5,27.81 62.36,26.67 CSHB.3
FAH
  Top 0.254: IC3.13 73.28,24.13 72.14,25.27 62.1,25.27 CSHB.5
FBH
  Top 0.254: IC3.12 73.28,21.59 72.14,22.73 62.1,22.73 CSHB.7
GND  (via drill 0.35)
  Top 0.508: IC2.13 IC2.12 49.66,54.74 51.69,52.7 51.69,51.44 49.91,49.66 49.66,49.66 IC2.10 IC2.9 49.4,46.86 49.15,46.86 v46.74,44.45 v46.74,36.07 | IC2.7 36.83,39.37 IC1.31 29.08,39.24 27.05,41.27 27.05,50.16 19.05,58.17 C1.1 | v10.03,67.31 v7.37,64.64 | D.28 8.89,10.16 11.81,7.24 | BUS.49 11.81,7.24 | IC3.8 71.12,11.05 74.93,7.24 | 74.93,7.24 75.18,6.99 75.18,5.33 BUS.2 | IC5.13 IC5.12 | IC5.2 IC5.1 43.18,30.48 C5.1 | v18.8,14.22 11.81,7.24 | v20.57,16.89 20.83,16.89 21.34,17.4 26.92,17.4 v27.05,17.53 | C3.1 75.44,36.83 78.99,33.27 80.01,33.27 80.9,32.38 80.9,13.21 74.93,7.24
  Bottom 0.508: IC2.13 49.28,57.15 47.37,59.05 47.37,61.59 44.2,64.77 C2.1 30.48,77.47 T.33 | D.17 3.81,38.48 7.37,42.04 v7.37,64.64 | C1.1 v10.03,67.31 | IC2.7 v46.74,44.45 | C3.1 72.39,37.72 71.12,38.99 IC4.8 71.25,44.32 73.28,46.35 73.28,54.23 74.42,55.37 74.42,64.77 72.39,66.8 C4.1 | IC5.4 IC5.5 41.66,19.05 39.75,17.14 39.75,15.88 41.66,13.97 IC5.7 42.04,13.84 43.94,13.84 47.75,10.03 63.37,10.03 67.31,13.97 IC3.8 | IC5.13 44.7,26.67 44.45,26.42 44.07,26.42 | 44.07,26.42 42.16,26.42 IC5.2 | 44.07,26.42 44.07,23.5 42.29,21.72 42.04,21.72 IC5.4 | v18.8,14.22 18.8,14.99 20.57,16.76 v20.57,16.89 | v27.05,17.53 27.05,13.34 28.19,12.19 34.04,12.19 34.67,12.83 34.67,23.11 35.31,23.75 36.32,23.75 38.35,21.72 41.78,21.72 IC5.4 | v46.74,36.07 44.96,36.07 C5.1
  pour Bottom: -7.62,91.44 -7.62,-2.54 88.9,-2.54 88.9,91.44
IEI
  Top 0.254: IC1.6 13.97,49.91 9.02,54.86 9.02,56.64 5.46,60.2 5.46,64.39 4.95,64.9 4.95,69.98 D.4
IEIE
  Top 0.254: D.3 3.81,74.55 10.16,80.9 R1.P$1
IEO
  Bottom 0.254: IC1.7 13.97,47.37 15.75,49.15 15.75,54.99 14.73,56.01 12.95,56.01 8.38,60.58 8.38,65.28 7.3,66.36 | 7.3,66.36 5.08,68.58 D.5 | T.39 22.86,78.99 12.19,68.33 9.27,68.33 7.3,66.36
RIA
  Top 0.254: IC1.11 13.97,37.21 4.95,46.23 4.95,52.2 D.11
RIB  (via drill 0.35)
  Top 0.254: v23.88,29.46 18.92,29.46 14.86,25.4 D.22
  Bottom 0.254: IC1.29 29.21,33.91 26.67,31.37 26.67,29.84 26.29,29.46 v23.88,29.46
RTSA
  Top 0.254: IC1.17 3.43,21.59 1.65,23.37 1.65,57.91 3.3,59.56 4.32,59.56 4.95,58.93 4.95,57.91 4.06,57.02 3.3,57.02 2.67,56.39 2.67,51.94 D.12
RTSB
  Top 0.254: IC1.24 16.13,21.59 14.86,22.86 D.23
RXCA  (via drill 0.35)
  Top 0.254: IC1.13 6.73,31.75 4.06,34.42 3.3,34.42 2.67,35.05 2.67,36.07 3.3,36.7 4.95,36.7 7.37,39.12 7.37,41.27 4.06,44.58 3.3,44.58 2.67,45.21 2.67,49.4 v2.92,49.66
  Bottom 0.254: v2.92,49.66 2.92,50.04 2.67,50.29 2.67,62.36 D.7
RXDA  (via drill 0.35)
  Top 0.254: v8.51,54.23 8.51,56.39 4.95,59.94 4.95,64.14 3.81,65.28 D.6
  Bottom 0.254: IC1.12 13.97,34.67 8.51,40.13 v8.51,54.23
RXDB
  Top 0.254: IC1.28 20.07,31.75 16.26,35.56 D.18
RXTXCB
  Top 0.254: IC1.27 28.07,29.21 26.04,31.24 19.05,31.24 18.29,30.48 D.20
TXCA
  Top 0.254: IC1.14 3.43,29.21 2.16,30.48 2.16,56.77 D.9
TXDA
  Bottom 0.254: IC1.15 15.11,26.67 16.38,25.4 16.38,24.38 14.99,22.99 10.41,22.99 4.06,29.34 3.3,29.34 1.91,30.73 1.91,45.47 3.56,47.12 4.32,47.12 4.95,47.75 4.95,59.82 D.8
TXDB
  Bottom 0.254: IC1.26 21.97,26.67 19.3,29.34 19.3,32.51 18.8,33.02 D.19
VCC  (via drill 0.35)
  Top 0.508: IC4.16 78.74,63.75 77.47,65.02 C4.2 77.34,67.44 77.34,78.87 73.15,83.06 73.15,83.44 67.82,88.77 33.02,88.77 v32.51,88.27 | C2.2 48.26,60.96 IC2.14 49.66,59.56 49.91,59.56 52.32,57.15 52.32,53.59 52.7,53.21 52.7,42.67 48.26,38.23 C5.2 | IC3.16 75.44,31.75 70.87,36.32 | 70.87,36.32 70.87,37.34 71.88,38.35 75.95,38.35 C3.2 | IC5.14 52.7,29.21 58.55,35.05 69.6,35.05 70.87,36.32 | v28.07,84.96 T.34 | v6.22,53.34 6.35,53.21 6.35,49.28 13.72,41.91 IC1.9 14.1,41.78 16.26,43.94 v16.26,59.44 | R1.P$2 16.38,83.95 15.37,83.95 11.18,79.76 v11.18,66.17 | v17.78,32 17.78,32.51 v16.26,34.04
  Bottom 0.508: IC5.14 49.53,30.48 48.26,31.75 C5.2 | IC4.16 79.63,62.23 81.92,59.94 81.92,43.05 77.47,38.61 C3.2 | D.27 3.81,12.32 9.53,6.6 | 9.53,6.6 11.18,4.95 11.18,3.17 12.06,2.29 44.2,2.29 BUS.24 | R1.P$2 20.19,84.96 v28.07,84.96 28.19,84.84 29.97,84.84 30.61,85.47 30.61,86.11 32.51,88.01 v32.51,88.27 | v6.22,53.34 6.22,43.05 D.16 | v16.26,59.44 17.91,61.09 | 17.91,61.09 C1.2 | v11.18,66.17 12.83,66.17 17.91,61.09 | 9.53,6.6 16.38,13.46 16.38,20.57 17.78,21.97 v17.78,32 | v16.26,34.04 16.26,39.88 14.22,41.91 IC1.9
  pour Top: -1.27,91.44 -1.27,-1.27 88.9,-1.27 88.9,91.44
W/RDYA
  Top 0.254: IC1.10 5.46,47.88 5.46,52.58 4.95,53.09 4.95,54.74 D.10
W/RDYB  (via drill 0.35)
  Top 0.254: v19.43,25.53 16.13,25.53 v15.62,25.02 | v9.4,26.54 5.21,26.54 D.21
  Bottom 0.254: IC1.30 29.21,36.45 30.99,34.67 30.99,26.29 30.23,25.53 v19.43,25.53 | v15.62,25.02 15.24,25.02 14.73,25.53 10.41,25.53 v9.4,26.54

### Text on the board
tNames: CSHB | CSLB | CS | VCC | !HALT | CLK | !MREQ | !M1 | !RESET | !IORQ | !WR | !RD | D7 | D6 | D5 | D4 | D3 | D2 | D1 | D0 | INT | DINT | IEO | !INT | GND | A15 | A14 | A13 | A12 | A11 | A10 | A9 | A8 | A7 | A6 | A5 | A4 | A3 | A2 | A1 | A0 | IEIE | !DINT | IEI | IEO | RXDA | RXCA | TXDA | TXCA | WRDYA | RIA | RTSA | CTSA | E0 | DART | DTRA | F0 | DCDA | VCC | GND | RXDB | TXDB | RXTXCB | WRDYB | F8 | RIB | F9 | RTSB | FA | CTSB | FB | RABS664 Amstrad CPC Z80 DART V1.0 | DTRB | DCDB | VCC | GND